# EAGLE schematic INTELMOTICS (EAGLE 9.6.1)
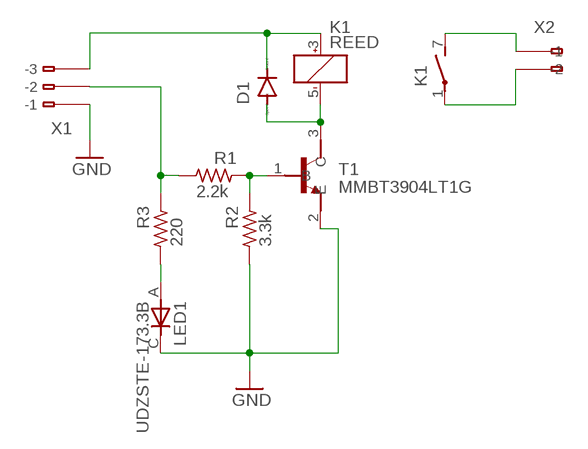
[diagram p0: schematic, sheet 1]

## Parts
D1  MBR0520LT  [SOD123]
K1  REED  [REED]
LED1  UDZSTE-173.3B  [SODFL2512X90N]
R1  2.2k  R_1206W  [R1206W]
R2  3.3k  R_1206W  [R1206W]
R3  220  R_1206W  [R1206W]
T1  MMBT3904LT1G  [SOT95P240X111-3N]
X1  234-203  [234-203]
X2  234-502  [234-502]

## Nets
GND: LED1.C R2.1 T1.2(E) X1.B1(B-1)
N$1: R1.1 R3.2 X1.B2(B-2)
N$2: R1.2 R2.2 T1.1(B)
N$3: D1.A K1.5(1:-) T1.3(C)
N$4: D1.C K1.3(1:+) X1.B3(B-3)
N$5: LED1.A R3.1
N$6: K1.7(2:S) X2.A1(-1)
N$7: K1.1(2:P) X2.A2(-2)
Unconnected: X1.A1(-1) X1.A2(-2) X1.A3(-3) X2.B1(B-1) X2.B2(B-2)

## Library data of the parts
D1 = diode:MBR0520LT: SCHOTTKY BARRIER RECTIFIER Source: http://onsemi.com .. MBR0520LT1-D.pdf
K1 = relay:REED: RELAY reed, 1 x norm. open with polarity, grid 5.08; OC_FARNELL: unknown; OC_NEWARK: unknown
LED1 = UDZSTE-173.3B:UDZSTE-173.3B: UDZS22B Series 27 V 0.1 uA 200 mW Surface Mount Zener Diode - SOD-323; AVAILABILITY: Unavailable; DESCRIPTION: Diodo Zener 3.3V 200mW ± 3% Montaje en superficie UMD2; MF: Rohm; MP: UDZSTE-173.3B; PACKAGE: SOD-323 Rohm; PRICE: None
R1-R3 = rc-master:R_: RESISTOR
T1 = MMBT3904LT1G:MMBT3904LT1G: MMBT Series 40 V 200 mA SMT NPN Silicon General Purpose Transistor - SOT-23 Check prices <https://pricing.snapeda.com/parts/MMBT3904LT1G/ON%20Semiconductor/view-part?ref=eda>; AVAILABILITY: Good; DESCRIPTION: Bipolar (BJT) Transistor NPN 40V 200mA 300MHz 300mW Surface Mount SOT-23-3 (TO-236); MF: ON Semiconductor; MP: MMBT3904LT1G; PACKAGE: SOT-23-3 ON Semiconductor; PRICE: None; PURCHASE-URL: https://pricing.snapeda.com/search/part/MMBT3904LT1G/?ref=eda
X1 = con-wago:234-203: WAGO Cage Clamp; MPN: 234-203; OC_FARNELL: unknown; OC_NEWARK: 28K9092
X2 = con-wago255:234-502: WAGO; MPN: 234-502; OC_FARNELL: 1777106; OC_NEWARK: 28K9105